# EAGLE schematic esp8266-pcb (EAGLE 6.4)
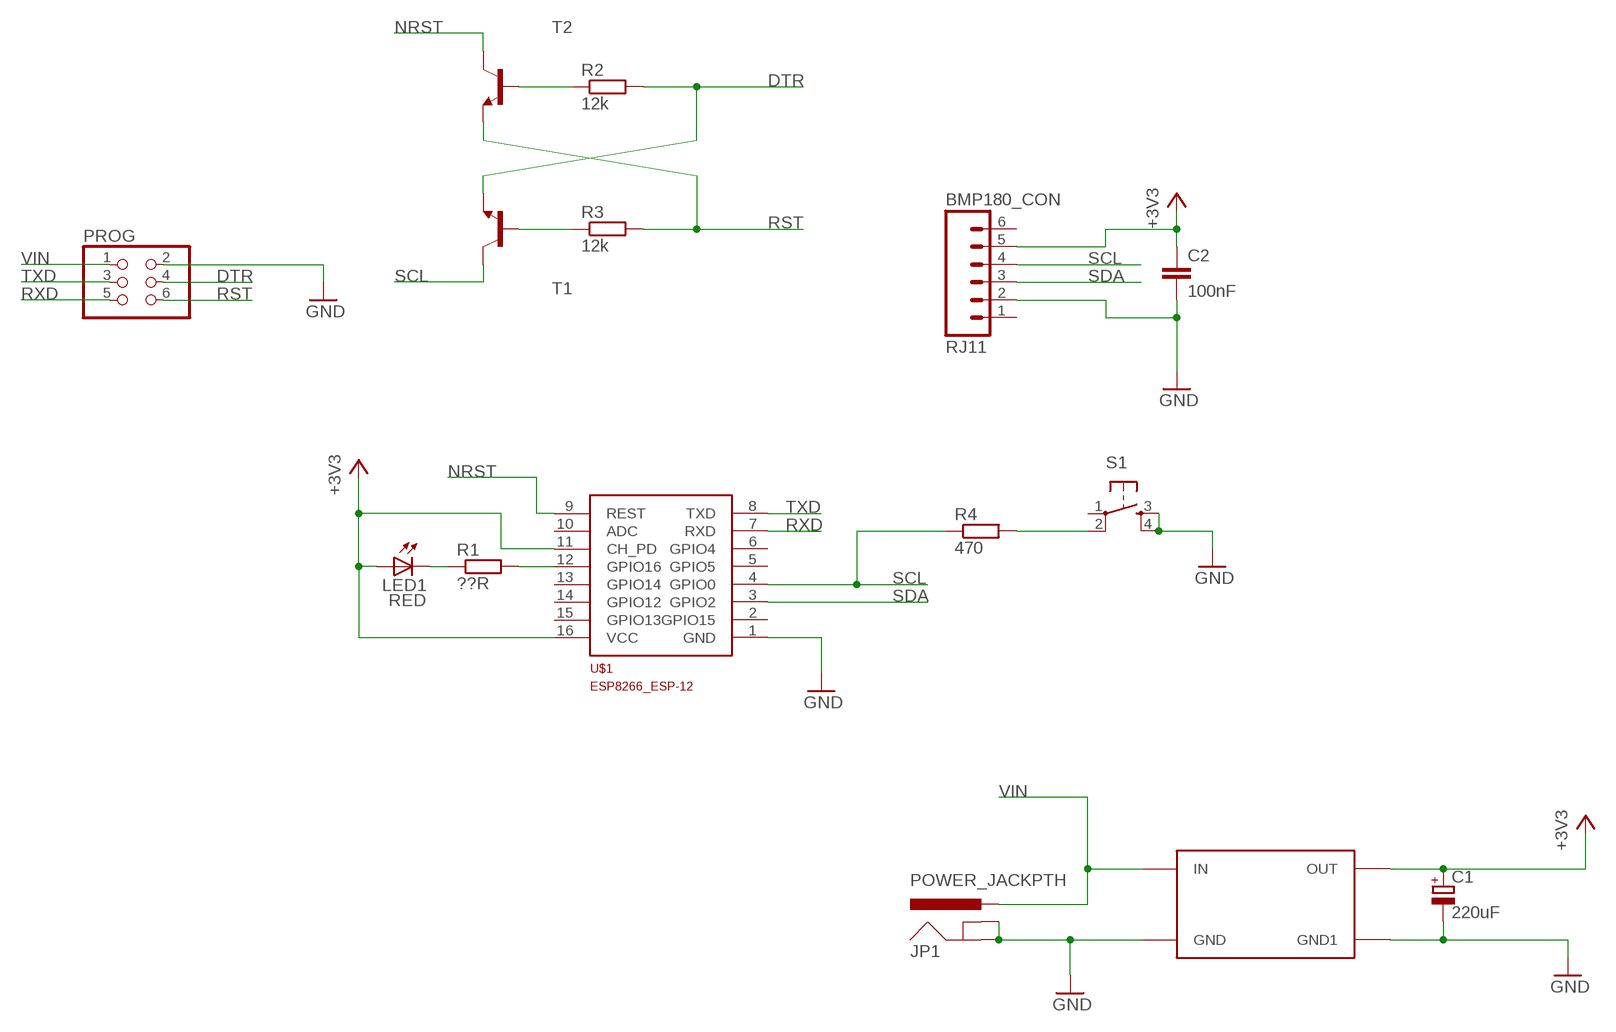
[diagram p0: schematic, sheet 1]

## Parts
BMP180_CON  RJ11  RJ11-6PTH  [RJ11-6]
C1  220uF  CPOL-EUE2.5-6  [E2,5-6]
C2  100nF  C-EUC0805  [C0805]
JP1  POWER_JACKPTH  [POWER_JACK_PTH]
LED1  RED  LED3MM  [LED3MM]
PROG  PINHD-2X3  [2X03]
R1  ??R  R-EU_0207/10  [0207/10]
R2  12k  R-EU_R0805  [R0805]
R3  12k  R-EU_R0805  [R0805]
R4  470  R-EU_R0805  [R0805]
S1  TAC_SWITCHPTH  [TACTILE-PTH]
T1  BC808-NPN-SOT23-BEC  [SOT23-BEC]
T2  BC808-NPN-SOT23-BEC  [SOT23-BEC]
U$1  ESP8266_ESP-12  [ESP8266-ESP12]
U$2  DC-DC-SMALL  [DC-DC]

## Nets
+3V3: BMP180_CON.5 C1.+ C2.1 LED1.A U$1.11(CH_PD) U$1.16(VCC) U$2.P$2(OUT)
DTR: PROG.4 R2.2 T1.E
GND: BMP180_CON.2 C1.- C2.2 JP1.GND JP1.GNDBREAK PROG.2 S1.3 S1.4 U$1.1(GND) U$2.P$3(GND) U$2.P$4(GND1)
N$1: LED1.K(C) R1.1
N$2: R1.2 U$1.12(GPIO16)
N$3: R2.1 T2.B
N$4: R4.2 S1.2
N$7: R3.1 T1.B
NRST: T2.C U$1.9(REST)
RST: PROG.6 R3.2 T2.E
RXD: PROG.5 U$1.7(RXD)
SCL: BMP180_CON.4 R4.1 T1.C U$1.4(GPIO0)
SDA: BMP180_CON.3 U$1.3(GPIO2)
TXD: PROG.3 U$1.8(TXD)
VIN: JP1.PWR PROG.1 U$2.P$1(IN)
Unconnected: BMP180_CON.1 BMP180_CON.6 S1.1 U$1.2(GPIO15) U$1.5(GPIO5) U$1.6(GPIO4) U$1.10(ADC) U$1.13(GPIO14) U$1.14(GPIO12) U$1.15(GPIO13)

## Library data of the parts
BMP180_CON = SparkFun-Connectors:RJ11-6: RJ11 Jack Simple 6 pin RJ11 jack. Commonly found on CAT3 devices and Microchip programmers. SKU: PRT-00132; PROD_ID: CONN-08590
C1 = rcl:CPOL-EU: POLARIZED CAPACITOR, European symbol
C2 = rcl:C-EU: CAPACITOR, European symbol
JP1 = SparkFun-Connectors:POWER_JACK: Power Jack This is the standard 5.5mm barrel jack for power. The PTH is the most common, proven, reliable, footprint. The Slot footprint only works if the mill layer is transmitted to the PCB fab house so be warned. Mating wall wart : TOL-00298 (and others); PROD_ID: CONN-08197
LED1 = adafruit:LED: LED OSRAM: - CHIPLED LG R971, LG N971, LY N971, LG Q971, LY Q971, LO R971, LY R971 LH N974, LH R974 LS Q976, LO Q976, LY Q976 LO Q996 - Hyper CHIPLED LW Q18S LB Q993, LB Q99A, LB R99A - SideLED LS A670, LO A670, LY A670, LG A670, LP A670 LB A673, LV A673, LT A673, LW A673 LH A674 LY A675 LS A676, LA A676, LO A676, LY A676, LW A676 LS A679, LY A679, LG A679 - Hyper Micro SIDELED® LS Y876, LA Y876, LO Y876, LY Y876 LT Y87S - SmartLED LW L88C, LW L88S LB L89C, LB L89S, LG L890 LS L89K, LO L89K, LY L89K LS L896, LA L896, LO L896, LY L896 - TOPLED LS T670, LO T670, LY T670, LG T670, LP T670 LSG T670, LSP T670, LSY T670, LOP T670, LYG T670 LG T671, LOG T671, LSG T671 LB T673, LV T673, LT T673, LW T673 LH T674 LS T676, LA T676, LO T676, LY T676, LB T676, LH T676, LSB T676, LW T676 LB T67C, LV T67C, LT T67C, LS T67K, LO T67K, LY T67K, LW E67C LS E67B, LA E67B, LO E67B, LY E67B, LB E67C, LV E67C, LT E67C LW T67C LS T679, LY T679, LG T679 LS T770, LO T770, LY T770, LG T770, LP T770 LB T773, LV T773, LT T773, LW T773 LH T774 LS E675, LA E675, LY E675, LS T675 LS T776, LA T776, LO T776, LY T776, LB T776 LHGB T686 LT T68C, LB T68C - Hyper Mini TOPLED® LB M676 - Mini TOPLED Santana® LG M470 LS M47K, LO M47K, LY M47K Source: http://www.osram.convergy.de/
PROG = pinhead:PINHD-2X3: PIN HEADER
R1-R4 = rcl:R-EU_: RESISTOR, European symbol
S1 = SparkFun-Retired:TAC_SWITCH: Momentary Switch Button commonly used for reset or general input. Spark Fun Electronics SKU : COM-00097 SMT- SWCH-08247
T1 T2 = transistor:*-NPN-: NPN Transistror BF959 corrected 2008.03.06
U$1 = ESP8266-ESP12:ESP8266_ESP-12
U$2 = OK1CDJ-E6:DC-DC-SMALL